# Altium schematic sheet RP2040-MCU.SchDoc
size A3; SheetNumber: 1; SheetTotal: 1
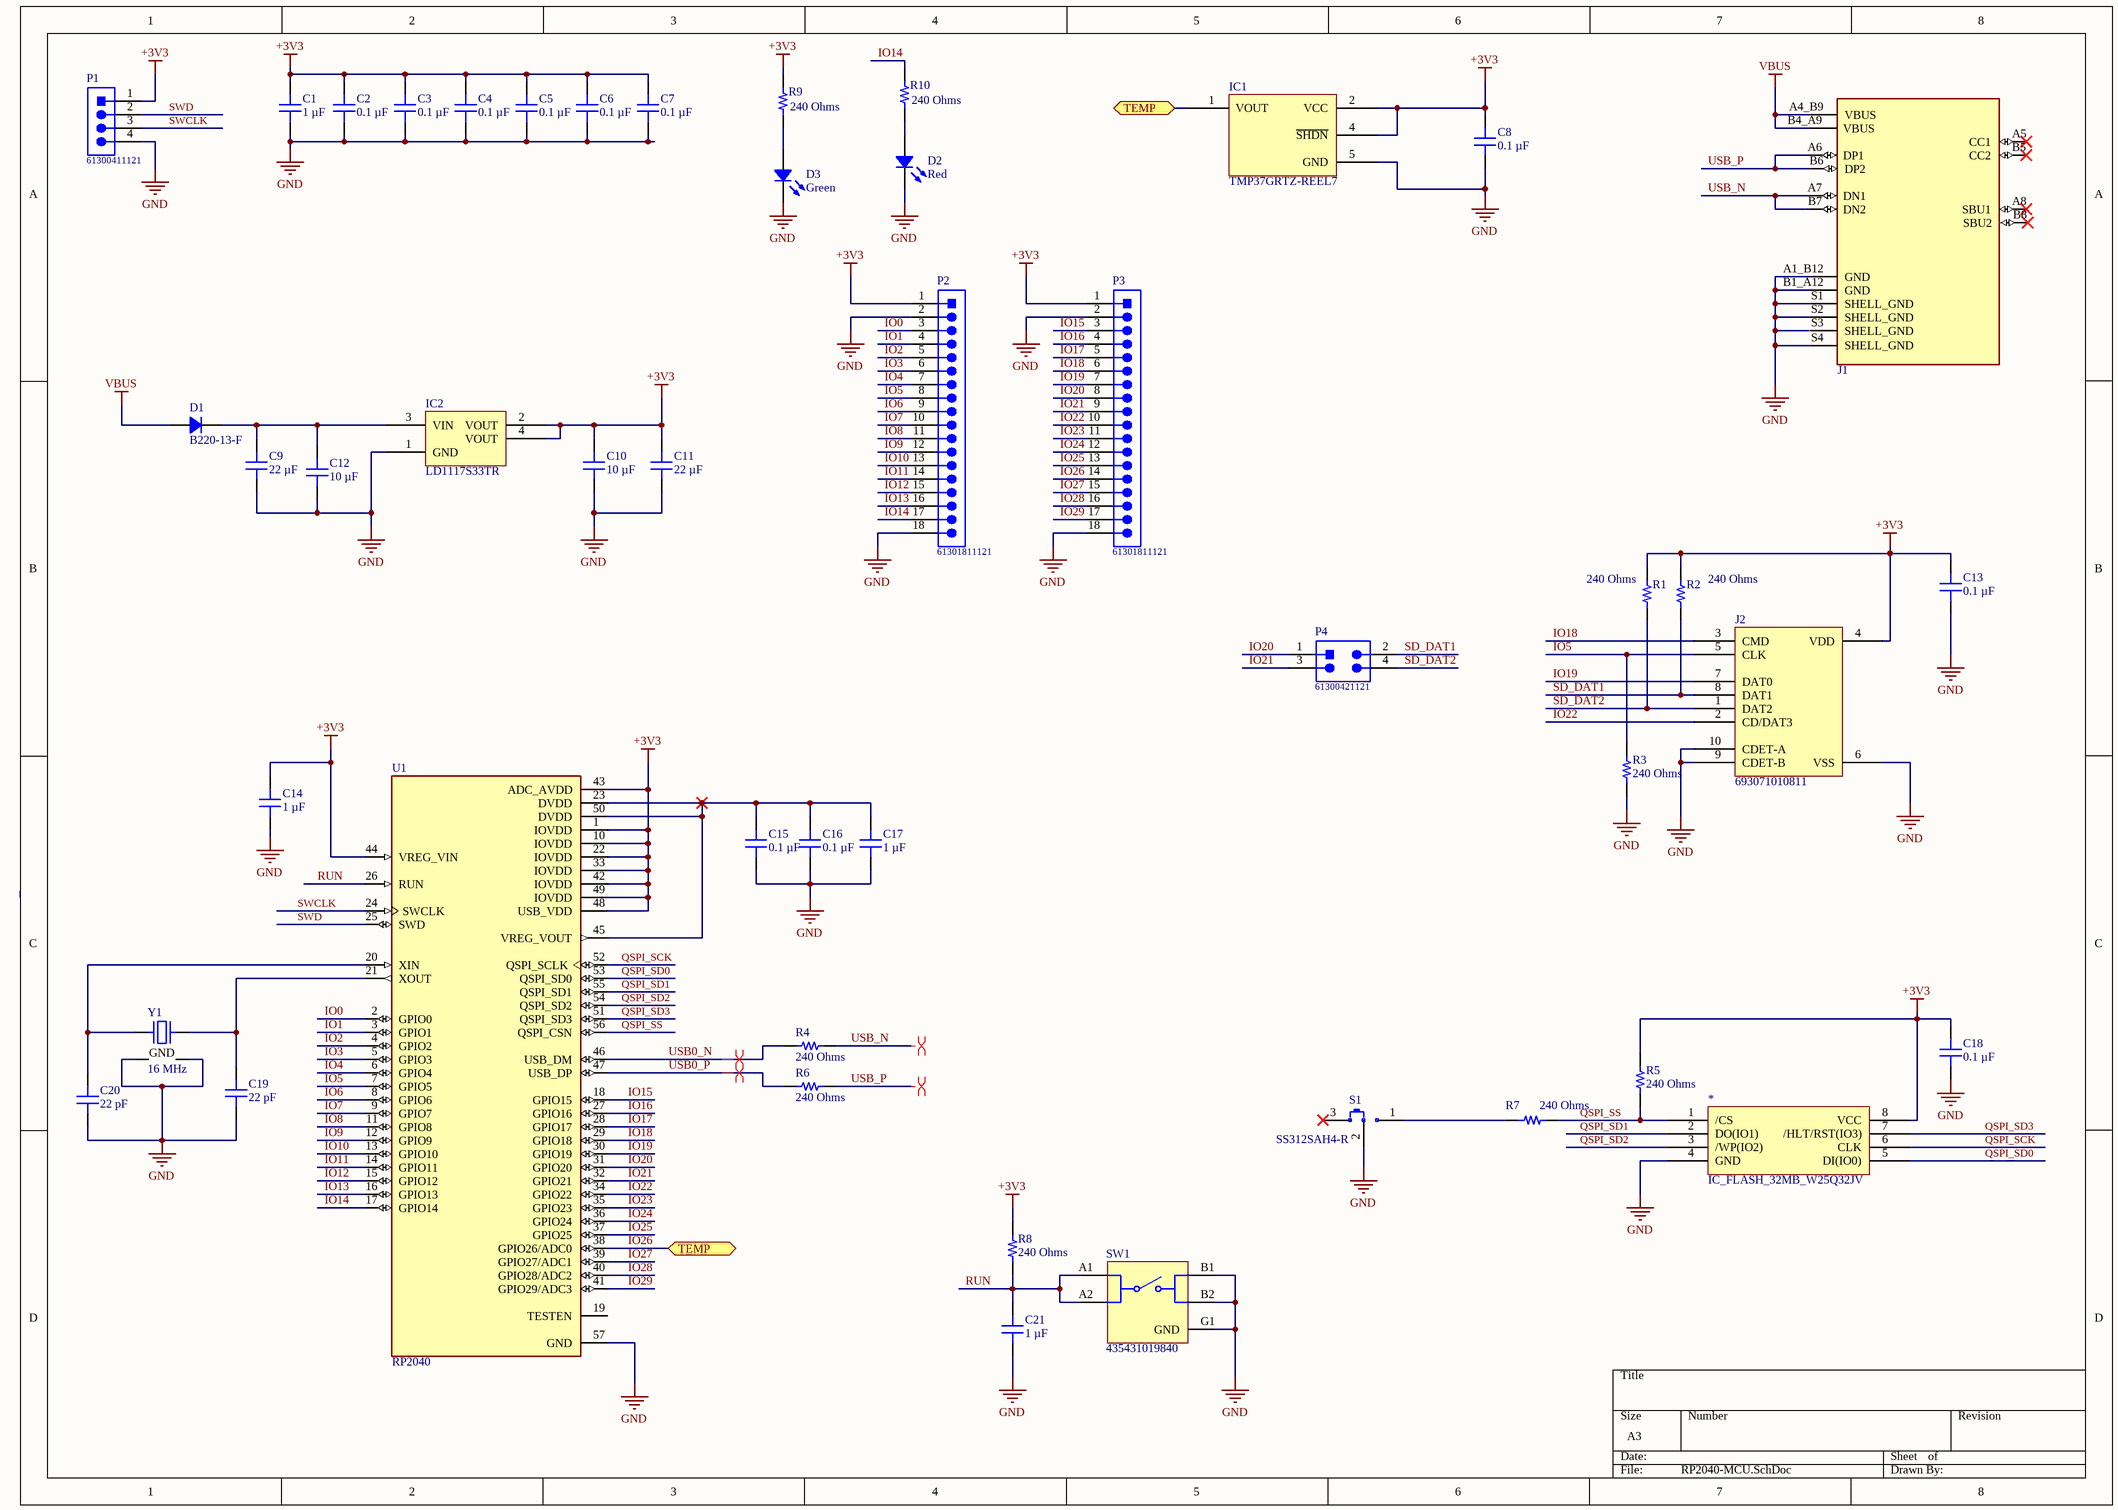
[diagram p0: RP2040-MCU.SchDoc]

## Parts
*  IC_FLASH_32MB_W25Q32JV  [SOIC_8]
C1  1 µF  [CAP 0603_1608]
C2  0.1 µF  [CAP 0603_1608]
C3  0.1 µF  [CAP 0603_1608]
C4  0.1 µF  [CAP 0603_1608]
C5  0.1 µF  [CAP 0603_1608]
C6  0.1 µF  [CAP 0603_1608]
C7  0.1 µF  [CAP 0603_1608]
C8  0.1 µF  [CAP 0603_1608]
C9  22 µF  [CAP 1206_3216 - 0.8MM]
C10  10 µF  [CAP 0805_2012]
C11  22 µF  [CAP 1206_3216 - 0.8MM]
C12  10 µF  [CAP 0805_2012]
C13  0.1 µF  [CAP 0603_1608]
C14  1 µF  [CAP 0603_1608]
C15  0.1 µF  [CAP 0603_1608]
C16  0.1 µF  [CAP 0603_1608]
C17  1 µF  [CAP 0603_1608]
C18  0.1 µF  [CAP 0603_1608]
C19  22 pF  [CAP 0603_1608]
C20  22 pF  [CAP 0603_1608]
C21  1 µF  [CAP 0603_1608]
D1  B220-13-F  [DO214AA SMB]
D2  Red  [LED 1206_3216 RED]
D3  Green  [LED 0805_2012 GREEN]
IC1  TMP37GRTZ-REEL7  [ANALOG SOT-23-5 RJ-5]
IC2  LD1117S33TR  [ST SOT-223]
J1  USB 2.0 Type C Connector  [GCT_USB4105-GF-A]  (value not drawn)
J2  693071010811  [WURTH 693071010811]
P1  61300411121  [61300411121]
P2  61301811121  [61301811121]
P3  61301811121  [61301811121]
P4  61300421121  [61300421121]
R1  240 Ohms  [RES 0805_2012]
R2  240 Ohms  [RES 0805_2012]
R3  240 Ohms  [RES 0805_2012]
R4  240 Ohms  [RES 0805_2012]
R5  240 Ohms  [RES 0805_2012]
R6  240 Ohms  [RES 0805_2012]
R7  240 Ohms  [RES 0805_2012]
R8  240 Ohms  [RES 0805_2012]
R9  240 Ohms  [RES 0805_2012]
R10  240 Ohms  [RES 0805_2012]
S1  SS312SAH4-R  [NKK SS312SAH4]
SW1  435431019840  [WS-TASV_L4.1W2.8H1.9_4354x10198x0]
U1  RP2040  [QFN40P700X700X90-57N-RP2040]
Y1  16 MHz  [NDK NX3225SA]

## Ports
TEMP (bidir)

## Nets
+3V3: *.8(VCC) C1.2 C2.2 C3.2 C4.2 C5.2 C6.2 C7.2 C8.2 C10.2 C11.2 C13.2 C14.2 C18.2 IC1.2(VCC) IC1.4(~{SHDN}) IC2.2(VOUT) IC2.4(VOUT) J2.4(VDD) P1.1 P2.1 P3.1 R1.2 R2.2 R5.2 R8.2 R9.1 U1.1(IOVDD) U1.10(IOVDD) U1.22(IOVDD) U1.33(IOVDD) U1.42(IOVDD) U1.43(ADC_AVDD) U1.44(VREG_VIN) U1.48(USB_VDD) U1.49(IOVDD)
GND: *.4(GND) C1.1 C2.1 C3.1 C4.1 C5.1 C6.1 C7.1 C8.1 C9.1 C10.1 C11.1 C12.1 C13.1 C14.1 C15.1 C16.1 C17.1 C18.1 C19.1 C20.1 C21.1 D2.2 D3.2 IC1.5(GND) IC2.1(GND) J1.A1_B12(GND) J1.B1_A12(GND) J1.S1(SHELL_GND) J1.S2(SHELL_GND) J1.S4(SHELL_GND) J2.6(VSS) J2.9(CDET-B) J2.10(CDET-A) P1.4 P2.2 P2.18 P3.2 P3.18 R3.1 S1.2(COM) SW1.B1 SW1.B2 SW1.G1(GND) U1.57(GND) Y1.2(GND) Y1.4(GND)
VBUS: D1.1 J1.A4_B9(VBUS) J1.B4_A9(VBUS)
IO0: P2.3 U1.2(GPIO0)
IO1: P2.4 U1.3(GPIO1)
IO2: P2.5 U1.4(GPIO2)
IO3: P2.6 U1.5(GPIO3)
IO4: P2.7 U1.6(GPIO4)
IO5: J2.5(CLK) P2.8 R3.2 U1.7(GPIO5)
IO6: P2.9 U1.8(GPIO6)
IO7: P2.10 U1.9(GPIO7)
IO8: P2.11 U1.11(GPIO8)
IO9: P2.12 U1.12(GPIO9)
IO10: P2.13 U1.13(GPIO10)
IO11: P2.14 U1.14(GPIO11)
IO12: P2.15 U1.15(GPIO12)
IO13: P2.16 U1.16(GPIO13)
IO14: P2.17 R10.1 U1.17(GPIO14)
IO15: P3.3 U1.18(GPIO15)
IO16: P3.4 U1.27(GPIO16)
IO17: P3.5 U1.28(GPIO17)
IO18: J2.3(CMD) P3.6 U1.29(GPIO18)
IO19: J2.7(DAT0) P3.7 U1.30(GPIO19)
IO20: P3.8 P4.1 U1.31(GPIO20)
IO21: P3.9 P4.3 U1.32(GPIO21)
IO22: J2.2(CD/DAT3) P3.10 U1.34(GPIO22)
IO23: P3.11 U1.35(GPIO23)
IO24: P3.12 U1.36(GPIO24)
IO25: P3.13 U1.37(GPIO25)
IO26: IC1.1(VOUT) P3.14 U1.38(GPIO26/ADC0) ; port TEMP
IO27: P3.15 U1.39(GPIO27/ADC1)
IO28: P3.16 U1.40(GPIO28/ADC2)
IO29: P3.17 U1.41(GPIO29/ADC3)
QSPI_SCK: *.6(CLK) U1.52(QSPI_SCLK)
QSPI_SD0: *.5(DI(IO0)) U1.53(QSPI_SD0)
QSPI_SD1: *.2(DO(IO1)) U1.55(QSPI_SD1)
QSPI_SD2: *.3(/WP(IO2)) U1.54(QSPI_SD2)
QSPI_SD3: *.7(/HLT/RST(IO3)) U1.51(QSPI_SD3)
QSPI_SS: *.1(/CS) R5.1 R7.1 U1.56(QSPI_CSN)
RUN: C21.2 R8.1 SW1.A1 SW1.A2 U1.26(RUN)
SD_DAT1: J2.8(DAT1) P4.2 R2.1
SD_DAT2: J2.1(DAT2) P4.4 R1.1
SWCLK: P1.3 U1.24(SWCLK)
SWD: P1.2 U1.25(SWD)
USB0_N: R4.1 U1.46(USB_DM)
USB0_P: R6.1 U1.47(USB_DP)
USB_N: J1.A7(DN1) J1.B7(DN2) R4.2
USB_P: J1.A6(DP1) J1.B6(DP2) R6.2
NetC9_2: C9.2 C12.2 D1.2 IC2.3(VIN)
NetC15_2: C15.2 C16.2 C17.2 U1.23(DVDD) U1.45(VREG_VOUT) U1.50(DVDD)
NetC19_2: C19.2 U1.21(XOUT) Y1.3
NetC20_2: C20.2 U1.20(XIN) Y1.1
NetD2_1: D2.1 R10.2
NetD3_1: D3.1 R9.2
NetR7_2: R7.2 S1.1

Not connected (* = marked no-connect by the designer): J1 A5(CC1)* A8(SBU1)* B5(CC2)* B8(SBU2)* S3(SHELL_GND); S1 3*; U1 19(TESTEN)

## Layout directives
differential pair: USB0_N, USB0_P, USB_N, USB_P

## Library data of the parts
C1 C14 C17 C21 = CC0603KRX7R6BB105: CAP CER 1UF 10V X7R 0603; manufacturer: Yageo; Tolerance: ±10%; Part Number: CC0603KRX7R6BB105; Value: 1 µF; Applications: General Purpose; Capacitance: 1 µF; componentlink1description: Datasheet; componentlink1url: https://www.yageo.com/upload/media/product/productsearch/datasheet/mlcc/UPY-GPHC_X7R_6.3V-to-50V_18.pdf; componentlink2description: DigiKey Link; componentlink2url: https://www.digikey.com/en/products/detail/yageo/CC0603KRX7R6BB105/5195204; Device Package: 0603 (1608 Metric); lastupdated: 6/18/2022 5:53:25 AM; Lifecycle Status: Active; Minimum Order: 1; Mounting Type: Surface Mount, MLCC; Operating Temperature: -55°C ~ 125°C; Package / Case: 0603 (1608 Metric); packaging: TapeAndReel; partid: 2290; Part Status: Active; price: 0.02; series: CC; Size / Dimension: 0.063" L x 0.031" W (1.60mm x 0.80mm); Supplier 1: DigiKey; Supplier Part Number 1: 311-1796-1-ND; Temperature Coefficient: X7R; Thickness (Max): 0.035" (0.90mm); Voltage - Rated: 10V
C2-C8 C13 C15 C16 C18 = C0603C104K5RAC7411: CAP CER 0.1UF 50V X7R 0603; manufacturer: KEMET; Tolerance: ±10%; Part Number: C0603C104K5RAC7411; Value: 0.1 µF; Applications: Bypass, Decoupling; Capacitance: 0.1 µF; componentlink1description: Datasheet; componentlink1url: https://api.kemet.com/component-edge/download/datasheet/C0603C104K5RAC7411.pdf; componentlink2description: DigiKey Link; componentlink2url: https://www.digikey.com/en/products/detail/kemet/C0603C104K5RAC7411/3317013; Device Package: 0603 (1608 Metric); lastupdated: 6/18/2022 5:53:25 AM; Lifecycle Status: Active; Minimum Order: 15000; Mounting Type: Surface Mount, MLCC; Operating Temperature: -55°C ~ 125°C; Package / Case: 0603 (1608 Metric); packaging: TapeAndReel; partid: 2233; Part Status: Active; price: 0.01; series: SMD Comm X7R; Size / Dimension: 0.063" L x 0.031" W (1.60mm x 0.80mm); Supplier 1: DigiKey; Supplier Part Number 1: 399-7374-2-ND; Temperature Coefficient: X7R; Thickness (Max): 0.035" (0.90mm); Voltage - Rated: 50V
C9 C11 = CL31A226KOCLFNC: CAP CER 22UF 16V X5R 1206; manufacturer: Samsung Electro-Mechanics; Tolerance: ±10%; Part Number: CL31A226KOCLFNC; Value: 22 µF; Applications: General Purpose; Capacitance: 22 µF; componentlink1description: Datasheet; componentlink1url: http://www.samsungsem.com/kr/support/product-search/mlcc/CL31A226KOCLFNC.jsp; componentlink2description: DigiKey Link; componentlink2url: https://www.digikey.com/en/products/detail/samsung-electro-mechanics/CL31A226KOCLFNC/3888383; Device Package: 1206 (3216 Metric); lastupdated: 6/18/2022 5:59:04 AM; Lifecycle Status: Active; Minimum Order: 1; Mounting Type: Surface Mount, MLCC; Operating Temperature: -55°C ~ 85°C; Package / Case: 1206 (3216 Metric); packaging: TapeAndReel; partid: 18940; Part Status: Active; price: 0.10; series: CL; Size / Dimension: 0.126" L x 0.063" W (3.20mm x 1.60mm); Supplier 1: DigiKey; Supplier Part Number 1: 1276-2725-1-ND; Temperature Coefficient: X5R; Thickness (Max): 0.037" (0.95mm); Voltage - Rated: 16V
C10 C12 = CGA4J1X7R0J106K125AC: CAP CER 10UF 6.3V X7R 0805; manufacturer: TDK Corporation; Tolerance: ±10%; Part Number: CGA4J1X7R0J106K125AC; Value: 10 µF; Applications: Automotive; Capacitance: 10 µF; componentlink1description: Datasheet; componentlink1url: https://product.tdk.com/info/en/catalog/datasheets/mlcc_automotive_general_en.pdf?ref_disty=digikey; componentlink2description: DigiKey Link; componentlink2url: https://www.digikey.com/en/products/detail/tdk-corporation/CGA4J1X7R0J106K125AC/2672864; Device Package: 0805 (2012 Metric); lastupdated: 6/18/2022 5:56:43 AM; Lifecycle Status: Active; Minimum Order: 1; Mounting Type: Surface Mount, MLCC; Operating Temperature: -55°C ~ 125°C; Package / Case: 0805 (2012 Metric); packaging: TapeAndReel; partid: 3016; Part Status: Active; price: 0.08; Ratings: AEC-Q200; series: CGA; Size / Dimension: 0.079" L x 0.049" W (2.00mm x 1.25mm); Supplier 1: DigiKey; Supplier Part Number 1: 445-6971-1-ND; Temperature Coefficient: X7R; Thickness (Max): 0.057" (1.45mm); Voltage - Rated: 6.3V
C19 C20 = 251R14S220GV4T: CAP CER 22PF 250V C0G/NP0 0603; manufacturer: Johanson Technology Inc.; Temperature Coefficient: C0G, NP0; Tolerance: ±2%; Part Number: 251R14S220GV4T; Value: 22 pF; Applications: RF, Microwave, High Frequency; Capacitance: 22 pF; componentlink1description: Datasheet; componentlink1url: https://www.johansontechnology.com/downloads/catalog/johanson-technology-multi-layer-high-q-capacitors.pdf; componentlink2description: DigiKey Link; componentlink2url: https://www.digikey.com/en/products/detail/johanson-technology-inc/251R14S220GV4T/1561614; Device Package: 0603 (1608 Metric); Features: High Q, Low Loss, Ultra Low ESR; lastupdated: 6/18/2022 5:53:24 AM; Lifecycle Status: Active; Minimum Order: 1; Mounting Type: Surface Mount, MLCC; Operating Temperature: -55°C ~ 125°C; Package / Case: 0603 (1608 Metric); packaging: TapeAndReel; partid: 2703; Part Status: Active; price: 0.09; series: S; Size / Dimension: 0.062" L x 0.032" W (1.57mm x 0.81mm); Supplier 1: DigiKey; Supplier Part Number 1: 712-1331-1-ND; Thickness (Max): 0.035" (0.89mm); Voltage - Rated: 250V
D1 = B220-13-F: DIODE SCHOTTKY 20V 2A SMB; Manufacturer: Diodes Incorporated; Capacitance @ Vr, F: 200pF @ 4V, 1MHz; Current - Reverse Leakage @ Vr: 500 µA @ 20 V; Speed: Fast Recovery =< 500ns, > 200mA (Io); Voltage - Forward (Vf) (Max) @ If: 500 mV @ 2 A; Part Number: B220-13-F; ComponentLink1Description: Datasheet; ComponentLink1URL: https://www.diodes.com/assets/Datasheets/ds13004.pdf; ComponentLink2Description: DigiKey Link; ComponentLink2URL: https://www.digikey.com/en/products/detail/diodes-incorporated/B220-13-F/804864; Current - Average Rectified (Io): 2A; Diode Type: Schottky; LastUpdated: 6/18/2022 6:36:03 AM; Lifecycle Status: Active; Minimum Order: 1; Mounting Type: Surface Mount; Operating Temperature - Junction: -65°C ~ 150°C; Package / Case: DO-214AA, SMB; Packaging: TapeAndReel; PartId: 1374; Part Status: Active; Price: 0.07; Series: -; Supplier 1: DigiKey; Supplier Part Number 1: B220-FDICT-ND; Supplier Device Package: SMB; Voltage - DC Reverse (Vr) (Max): 20 V
D2 = APTD3216LSURCK: LED RED CLEAR 2SMD; Manufacturer: Kingbright; Configuration: Standard; Current - Test: 2mA; Lens Color: Colorless; Lens Size: 1.60mm Dia; Lens Style: Round with Domed Top; Millicandela Rating: 150mcd; Viewing Angle: 40°; Voltage - Forward (Vf) (Typ): 1.75V; Wavelength - Dominant: 630nm; Wavelength - Peak: 645nm; Part Number: APTD3216LSURCK; Color: Red; ComponentLink1Description: Datasheet; ComponentLink1URL: http://www.kingbrightusa.com/images/catalog/SPEC/APTD3216LSURCK.pdf; ComponentLink2Description: DigiKey Link; ComponentLink2URL: https://www.digikey.com/en/products/detail/kingbright/APTD3216LSURCK/7043080; Device Package: 1206 (3216 Metric); Height (Max): 1.90mm; LastUpdated: 6/18/2022 6:39:53 AM; Lens Transparency: Clear; Lifecycle Status: Active; Minimum Order: 1; Mounting Type: Surface Mount; Package / Case: 1206 (3216 Metric); Packaging: TapeAndReel; PartId: 212; Part Status: Active; Price: 0.09; Series: -; Size / Dimension: 3.20mm L x 1.60mm W; Supplier 1: DigiKey; Supplier Part Number 1: 754-2050-1-ND; Supplier Device Package: 2-SMD; Value: Red
D3 = 5975316507F: LED GREEN 0805 SMD; Manufacturer: Dialight; Configuration: Standard; Current - Test: 20mA; Lens Color: 0.93mm; Lens Size: 1.40mm x 1.24mm; Lens Style: Rectangle with Flat Top; Millicandela Rating: 16mcd; Voltage - Forward (Vf) (Typ): 2.2V; Wavelength - Dominant: 560nm; Part Number: 5975316507F; Color: Green; ComponentLink1Description: Datasheet; ComponentLink1URL: http://www.dialightsignalsandcomponents.com/Assets/Drawings/2D_Drawings_DrawingDetailedSpec/NewDrawings/18370A.pdf; ComponentLink2Description: DigiKey Link; ComponentLink2URL: https://www.digikey.com/en/products/detail/dialight/5975316507F/9385444; Device Package: 0805 (2012 Metric); Height (Max): 0.93mm; LastUpdated: 6/18/2022 6:39:50 AM; Lifecycle Status: Active; Minimum Order: 1; Mounting Type: Surface Mount; Package / Case: 0805 (2012 Metric); Packaging: TapeAndReel; PartId: 245; Part Status: Active; Price: 0.13; Series: 597; Size / Dimension: 2.00mm L x 1.25mm W; Supplier 1: DigiKey; Supplier Part Number 1: 350-4389-1-ND; Supplier Device Package: 0805; Value: Green
IC1 = TMP37GRTZ-REEL7: SENSOR ANALOG 5C-100C SOT23-5; Manufacturer: Analog Devices Inc.; Accuracy - Highest (Lowest): ±3°C (±4°C); Output Type: Analog Voltage; Resolution: 20mV/°C; Sensing Temperature - Local: 5°C ~ 100°C; Sensor Type: Analog, Local; Test Condition: 25°C (5°C ~ 100°C); Voltage - Supply: 2.7V ~ 5.5V; Part Number: TMP37GRTZ-REEL7; ComponentLink1Description: Datasheet; ComponentLink1URL: https://www.analog.com/media/en/technical-documentation/data-sheets/TMP35_36_37.pdf; ComponentLink2Description: DigiKey Link; ComponentLink2URL: https://www.digikey.com/en/products/detail/analog-devices-inc/TMP37GRTZ-REEL7/995773; Features: Shutdown Mode; LastUpdated: 6/18/2022 6:54:11 AM; Lifecycle Status: Active; Minimum Order: 1; Mounting Type: Surface Mount; Operating Temperature: -40°C ~ 150°C; Package / Case: SC-74A, SOT-753; Packaging: TapeAndReel; Part Status: Active; Price: 1.01; Series: -; Supplier 1: DigiKey; Supplier Part Number 1: 505-TMP37GRTZ-REEL7CT-ND; Supplier Device Package: SOT-23-5
IC2 = LD1117S33TR: IC REG LINEAR 3.3V 800MA SOT223; Manufacturer: STMicroelectronics; Current - Quiescent (Iq): 10mA; Number of Regulators: 1; Output Configuration: Positive; Output Type: Fixed; Protection Features: Over Current, Over Temperature; PSRR: 75dB (120Hz); Voltage Dropout (Max): 1.2V @ 800mA; Voltage - Input (Max): 15V; Part Number: LD1117S33TR; ComponentLink1Description: Datasheet; ComponentLink1URL: http://www.st.com/content/ccc/resource/technical/document/datasheet/99/3b/7d/91/91/51/4b/be/CD00000544.pdf/files/CD00000544.pdf/jcr:content/translations/en.CD00000544.pdf; ComponentLink2Description: DigiKey Link; ComponentLink2URL: http://digikey.com/product-detail/en/stmicroelectronics/LD1117S33TR/497-1242-1-ND/586242; Current - Output: 800mA; LastUpdated: 6/18/2022 6:46:57 AM; Lifecycle Status: Active; Minimum Order: 1; Mounting Type: Surface Mount; Package / Case: TO-261-4, TO-261AA; Packaging: TapeAndReel; Part Status: Active; Price: 0.14; Series: -; Supplier 1: DigiKey; Supplier Part Number 1: 497-1242-1-ND; Supplier Device Package: SOT-223; Voltage - Output (Min/Fixed): 3.3V
J1 = CON_USB-C_USB4105-GF-A: USB-C (USB TYPE-C) USB 2.0 Receptacle Connector 24 (16+8 Dummy) Position Surface Mount, Right Angle; Through Hole; MF: GCT; Price: None; Value: *; MP: USB4105-GF-A; Package: None; Purchase-URL: https://pricing.snapeda.com/search/part/USB4105-GF-A/?ref=eda; SnapEDA_Link: https://www.snapeda.com/parts/USB4105-GF-A/Global%20Connector%20Technology/view-part/4423780/?ref=snap; Check_prices: https://www.snapeda.com/parts/USB4105-GF-A/Global%20Connector%20Technology/view-part/4423780/?ref=eda; Availability: Warning
J2 = 693071010811: CONN MICRO SD CARD PUSH-PUSH R/A; Manufacturer: Würth Elektronik; Card Type: Secure Digital - microSD™; Connector Type: Connector and Ejector; Insertion, Removal Method: Push In, Push Out; Number of Positions: 9 (8 + 1); Part Number: 693071010811; ComponentLink1Description: Datasheet; ComponentLink1URL: https://katalog.we-online.de/em/datasheet/693071010811.pdf; ComponentLink2Description: DigiKey Link; ComponentLink2URL: http://digikey.com/product-detail/en/w-rth-elektronik/693071010811/732-3819-1-ND/3124603; Contact Finish: Gold; Features: Switch; Height Above Board: 0.072" (1.83mm); LastUpdated: 5/24/2020 10:56:52 PM; Lifecycle Status: Active; Minimum Order: 1; Mounting Feature: Normal, Standard - Top; Mounting Type: Surface Mount, Right Angle; Packaging: TapeAndReel; Part Status: Active; Price: 1.89; Series: WR-CRD; Supplier 1: DigiKey; Supplier Part Number 1: 732-3819-1-ND
P1 = 61300411121: WR-PHD Pin Header, THT, pitch 2.54mm, Single Row, Vertical, 4p; Manufacturer: Wurth Elektronik; Pin Number: 4; Rated Current: 3A; Working Voltage: 250VAC; Withstanding Voltage: 500VAC; Contact Resistance: 20mOhm; ComponentLink1Description: Manufacturer; ComponentLink1URL: http://www.we-online.de; ComponentLink2Description: Datasheet; ComponentLink2URL: https://www.we-online.com/catalog/datasheet/61300411121.pdf; Manufacturer Part Number: 61300411121; Pitch: 2.54mm; Operating Temperature: -40 to +105degC; Mounting Technology: THT; Packaging: Bag; Gender: Pin Header; Row Number: Single; Orientation: Vertical
P2 P3 = 61301811121: WR-PHD Pin Header, THT, pitch 2.54mm, Single Row, Vertical, 18p; Manufacturer: Wurth Elektronik; Pin Number: 18; Rated Current: 3A; Working Voltage: 250VAC; Withstanding Voltage: 500VAC; Contact Resistance: 20mOhm; ComponentLink1Description: Manufacturer; ComponentLink1URL: http://www.we-online.de; ComponentLink2Description: Datasheet; ComponentLink2URL: https://www.we-online.com/catalog/datasheet/61301811121.pdf; Manufacturer Part Number: 61301811121; Pitch: 2.54mm; Operating Temperature: -40 to +105degC; Mounting Technology: THT; Packaging: Bag; Gender: Pin Header; Row Number: Single; Orientation: Vertical
P4 = 61300421121: WR-PHD Pin Header, THT, pitch 2.54mm, Dual Row, Vertical, 4p; Manufacturer: Wurth Elektronik; Pin Number: 4; Rated Current: 3A; Working Voltage: 250VAC; Withstanding Voltage: 500VAC; Contact Resistance: 20mOhm; ComponentLink1Description: Manufacturer; ComponentLink1URL: http://www.we-online.de; ComponentLink2Description: Datasheet; ComponentLink2URL: https://www.we-online.com/catalog/datasheet/61300421121.pdf; Manufacturer Part Number: 61300421121; Pitch: 2.54mm; Operating Temperature: -40 to +105degC; Mounting Technology: THT; Packaging: Bag; Gender: Pin Header; Row Number: Dual; Orientation: Vertical
R1-R10 = ERJ-PB6D2400V: RES SMD 240 OHM 0.5% 1/4W 0805; Manufacturer: Panasonic Electronic Components; Power (Watts): 0.25W, 1/4W; Temperature Coefficient: ±50ppm/°C; Part Number: ERJ-PB6D2400V; Value: 240 Ohms; ComponentLink1Description: Datasheet; ComponentLink1URL: https://industrial.panasonic.com/cdbs/www-data/pdf/RDM0000/AOA0000C328.pdf; ComponentLink2Description: DigiKey Link; ComponentLink2URL: https://www.digikey.com/en/products/detail/panasonic-electronic-components/ERJ-PB6D2400V/6213729; Composition: Thick Film; Device Package: 0805 (2012 Metric); Features: Automotive AEC-Q200, Pulse Withstanding; Height - Seated (Max): 0.028" (0.70mm); LastUpdated: 6/18/2022 6:27:53 AM; Lifecycle Status: Active; Minimum Order: 1; Number of Terminations: 2; Operating Temperature: -55°C ~ 155°C; Package / Case: 0805 (2012 Metric); Packaging: TapeAndReel; PartId: 27745; Part Status: Active; Price: 0.02; Ratings: AEC-Q200; Resistance: 240 Ohms; Series: ERJ-PB6; Size / Dimension: 0.079" L x 0.049" W (2.00mm x 1.25mm); Supplier 1: DigiKey; Supplier Part Number 1: P20946CT-ND; Supplier Device Package: 0805; Tolerance: ±0.5%
S1 = SS312SAH4-R: SWITCH SLIDE SPDT 0.4VA 28V; Manufacturer: NKK Switches; Actuator Length: 2.00mm; Actuator Type: Standard; Contact Timing: Shorting (MBB); Current Rating (Amps): 0.4VA (AC/DC); Switch Function: On-On; Part Number: SS312SAH4-R; Circuit: SPDT; ComponentLink1Description: Datasheet; ComponentLink1URL: http://www.nkkswitches.com/pdf/SS3surfaceMount-1.pdf; ComponentLink2Description: DigiKey Link; ComponentLink2URL: http://digikey.com/product-detail/en/nkk-switches/SS312SAH4-R/360-2924-1-ND/1051215; Contact Finish: Gold; Contact Material: Phosphor Bronze; LastUpdated: 1/4/2020 7:10:14 PM; Lifecycle Status: Active; Minimum Order: 1; Mounting Type: Surface Mount, Right Angle; Operating Temperature: -25°C ~ 85°C; Packaging: TapeAndReel; PartId: 1; Part Status: Active; Price: 1.95; Series: SS3; Supplier 1: DigiKey; Supplier Part Number 1: 360-2924-1-ND; Termination Style: Gull Wing; Voltage Rating - AC: 28V; Voltage Rating - DC: 28V
SW1 = 435431019840: WS-TASV SMT Washable Tact Switch, 32VDC, 50mA, 400g, height 1.9mm; Manufacturer: Wurth Elektronik; Actuator Color: Salmon; Electrical Life: 100000Cycles; Rated Voltage: 32V; Washable: Yes; ComponentLink1Description: Manufacturer Link; ComponentLink1URL: http://www.we-online.de; ComponentLink2Description: Datasheet; ComponentLink2URL: https://www.we-online.com/catalog/datasheet/435431019840.pdf; Mounting Technology: SMT; Packaging: Tape and Reel; Manufacturer Part Number: 435431019840; Contact Material: Stainless Steel; Contact Plating: Silver; Height: 1.9mm; Length: 4.1mm; Operating Temperature max.: 125C; Operating Temperature min.: -55C; Operation Force: 400g; Rated Current: 50mA; Terminal Material: Copper Alloy; Terminal Plating: Silver; Width: 2.8mm
U1 = RP2040: RP2040 chip for Raspberry Pi Pico - ARMÂ® CortexÂ®-M0+ MCU 32-Bit; SnapEDA_Link: https://www.snapeda.com/parts/RP2040/Raspberry+Pi/view-part/?ref=snap; Value: *; Purchase-URL: https://pricing.snapeda.com/search/part/RP2040/?ref=eda; MP: RP2040; Availability: In Stock; Check_prices: https://www.snapeda.com/parts/RP2040/Raspberry+Pi/view-part/?ref=eda; Package: None; MF: Raspberry Pi; Price: None
Y1 = NX3225SA-16.000000MHZ-B3: CRYSTAL 16.0000MHZ 7.2PF SMD; Manufacturer: NDK America, Inc.; ESR (Equivalent Series Resistance): 80 Ohms; Frequency Stability: ±15ppm; Frequency Tolerance: ±10ppm; Operating Mode: Fundamental; Part Number: NX3225SA-16.000000MHZ-B3; ComponentLink1Description: Datasheet; ComponentLink1URL: //media.digikey.com/pdf/Data Sheets/NDK PDFs/NX3225SA-16.000000MHz-B3.pdf; ComponentLink2Description: DigiKey Link; ComponentLink2URL: https://www.digikey.com/en/products/detail/ndk-america-inc/NX3225SA-16-000000MHZ-B3/1468340; Frequency: 16 MHz; Height - Seated (Max): 0.028" (0.70mm); LastUpdated: 6/18/2022 6:40:35 AM; Lifecycle Status: Active; Load Capacitance: 7.2pF; Minimum Order: 1; Mounting Type: Surface Mount; Operating Temperature: -30°C ~ 85°C; Package / Case: 4-SMD, No Lead; Packaging: TapeAndReel; PartId: 593; Part Status: Active; Price: 0.44; Series: NX3225SA; Size / Dimension: 0.126" L x 0.098" W (3.20mm x 2.50mm); Supplier 1: DigiKey; Supplier Part Number 1: 644-1099-1-ND; Type: MHz Crystal; Value: 16 MHz